# EasyEDA Pro project 单向户外电源_明月班.epro, schematic 后级H桥逆变

## Sheets
1 后级逆变: Board Name: 后级; Create Date: 2025-08-22; Page Name: 后级逆变; Project Name: 单向户外电源; Schematic Name: 后级H桥逆变; Update Date: 2025-09-10; Company: 嘉立创EDA; Page Size: A4; Version: V1.0
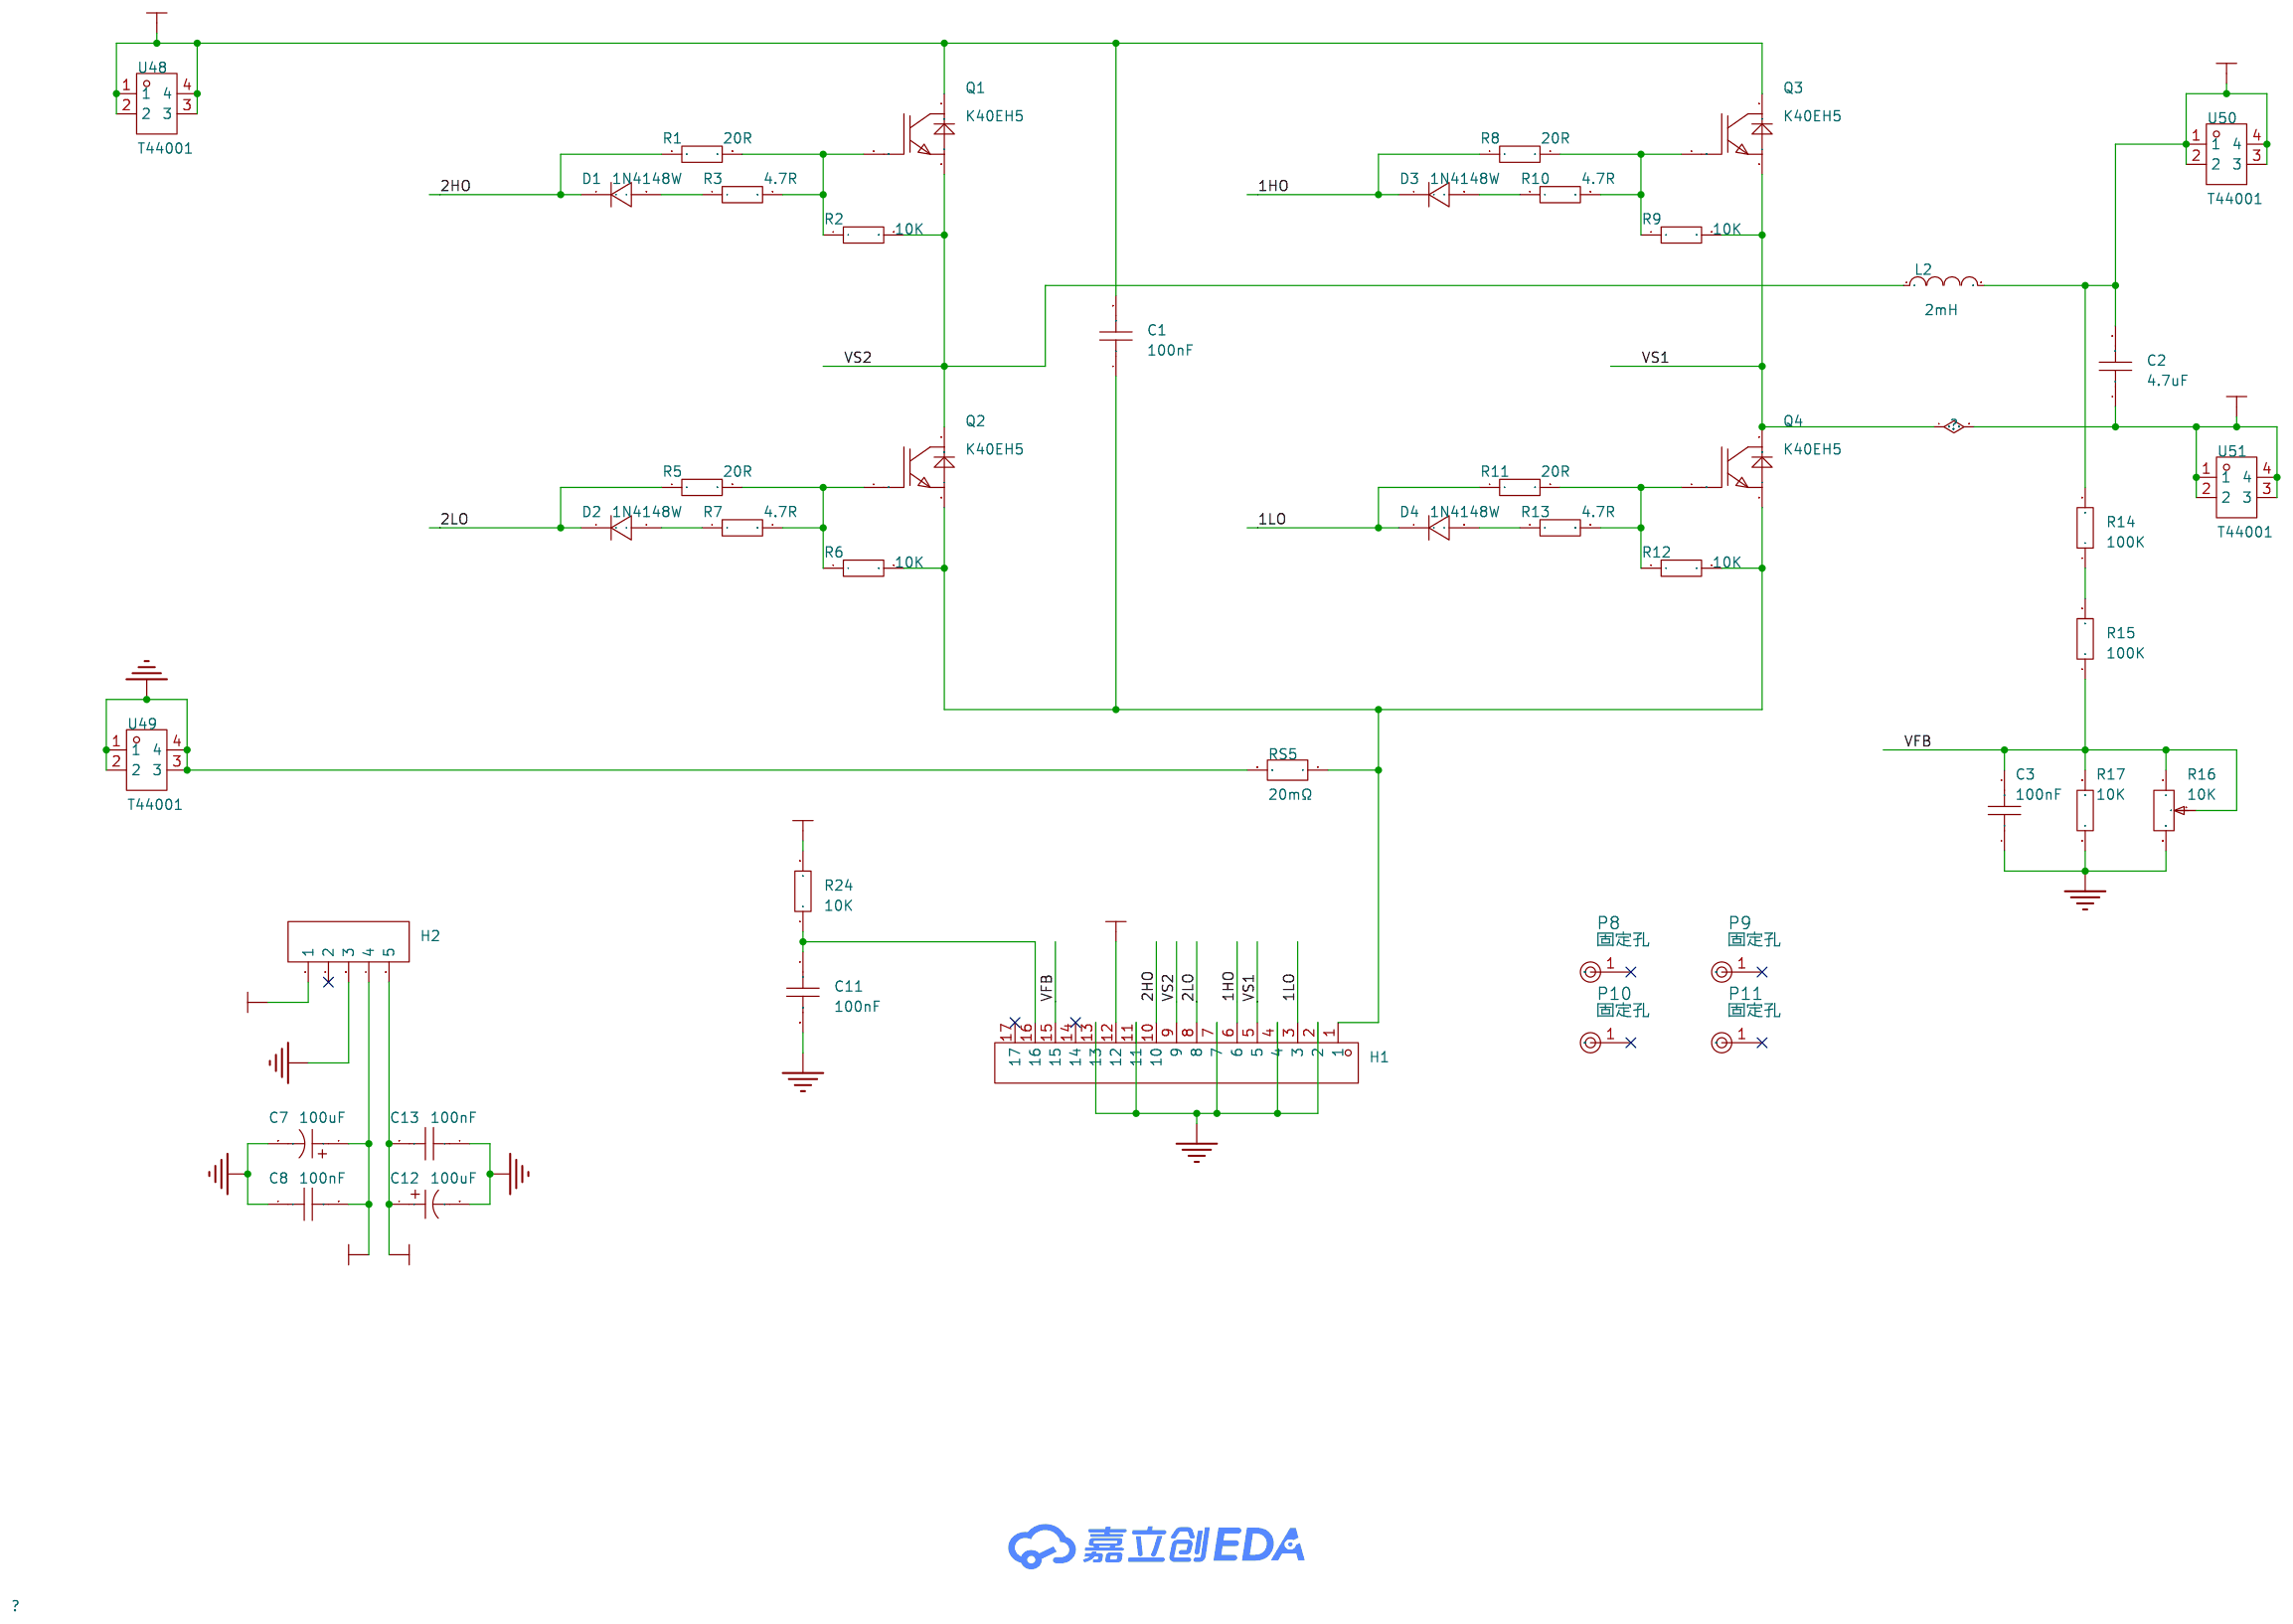
[diagram p3: 后级逆变]
2 P2控制
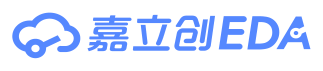
[diagram p4: P2控制]

## Parts
C1  100nF  [CAP-TH_L11.5-W5.5-P10.00-D0.6]
C2  4.7uF  [CAP-TH_L28.5-W15.5-P26.0-D0.8]
C3  100nF  [C0805]
C7  100uF  [CAP-TH_BD5.0-P2.00-D0.5-FD-1]
C8  100nF  [C0805]
C11  100nF  [C0805]
C12  100uF  [CAP-TH_BD5.0-P2.00-D0.5-FD-1]
C13  100nF  [C0805]
D1  1N4148W  [SOD-123F_L2.7-W1.6-LS3.8-RD]
D2  1N4148W  [SOD-123F_L2.7-W1.6-LS3.8-RD]
D3  1N4148W  [SOD-123F_L2.7-W1.6-LS3.8-RD]
D4  1N4148W  [SOD-123F_L2.7-W1.6-LS3.8-RD]
H1  -  [HDR-TH_17P-P2.54-V-F]
H2  -  [EG1185辅助电源]
L2  2mH  [2mH-D=36,插件脚距16]
P8  固定孔  [固定孔]
P9  固定孔  [固定孔]
P10  固定孔  [固定孔]
P11  固定孔  [固定孔]
Q1  K40EH5  [TO-220F-3_L10.5-W4.7-P2.54-L]
Q2  K40EH5  [TO-247AC-3_L15.8-W5.0-P5.46-L]
Q3  K40EH5  [TO-247AC-3_L15.8-W5.0-P5.46-L]
Q4  K40EH5  [TO-247AC-3_L15.8-W5.0-P5.46-L]
R1  20R  [R0805]
R2  10K  [R0805]
R3  4.7R  [R0805]
R5  20R  [R0805]
R6  10K  [R0805]
R7  4.7R  [R0805]
R8  20R  [R0805]
R9  10K  [R0805]
R10  4.7R  [R0805]
R11  20R  [R0805]
R12  10K  [R0805]
R13  4.7R  [R0805]
R14  100K  [R0805]
R15  100K  [R0805]
R16  10K  [RES-ADJ-TH_3362P]
R17  10K  [R0805]
R24  10K  [R0805]
RS5  20mΩ  [R2512]
U48  T44001  [CONN-TH_T44001]
U49  T44001  [CONN-TH_T44001]
U50  T44001  [CONN-TH_T44001]
U51  T44001  [CONN-TH_T44001]

## Library data of the parts
C1 = CBB21-630V104JP10: 容值:100nF;精度:±5%;额定电压:630V;工作温度:-40℃~+105℃;; LCSC Part Name: 100nF ±5% 630V; Supplier Part: C2888191; Manufacturer: 东通电子; Supplier Footprint: 插件,P=10mm; JLCPCB Part Class: 扩展库; Datasheet: https://atta.szlcsc.com/upload/public/pdf/source/20210928/C2888191_1A852CE2E5E8A960951618999EAEF1BB.pdf; Supplier: LCSC; Tolerance: ±5%; Voltage Rated: 630V; Operating Temperature: -40℃~+105℃
C2 = KP475J2J2603: 容值:4.7uF;精度:±5%;额定电压:630V;工作温度:-40℃~+100℃;; LCSC Part Name: 4.7uF ±5% 630V; Supplier Part: C3019080; Manufacturer: KYET(科雅); Supplier Footprint: 插件,P=26mm; JLCPCB Part Class: 扩展库; Datasheet: https://atta.szlcsc.com/upload/public/pdf/source/20220523/12B2B36D66F3FE6DA8C3B05150F96247.pdf; Supplier: LCSC; Tolerance: ±5%; Voltage Rated: 630V; Operating Temperature: -40℃~+100℃
C3 C8 C11 C13 = CAP_0805: Supplier Footprint: 0805
C7 C12 = JBLE2101M025A080RLM 100UF 25V: 容值:100uF;精度:±20%;额定电压:25V;纹波电流:1.1A@100kHz;等效串联电阻(ESR):40mΩ@100kHz;; LCSC Part Name: 100uF ±20% 25V; Supplier Part: C19270657; Manufacturer: DMBJ(振宝佳); Supplier Footprint: 插件,D5xL8mm; JLCPCB Part Class: 扩展库; Datasheet: https://atta.szlcsc.com/upload/public/pdf/source/20240115/41B2053578AA7A05F5193847DE8DA961.pdf; Supplier: LCSC; Tolerance: ±20%; Voltage Rating: 25V; Ripple Current: 1.1A@100kHz; Equivalent Series Resistance(ESR): 40mΩ@100kHz; Lifetime: 2000hrs@105℃
D1-D4 = 1N4148W_C81598: 二极管配置:独立式;正向压降(Vf):1V@50mA;直流反向耐压(Vr):75V;整流电流:150mA;反向恢复时间(Trr):4ns;; Supplier Part: C81598; Manufacturer: ST(先科); Supplier Footprint: SOD-123; JLCPCB Part Class: 基础库; Datasheet: https://item.szlcsc.com/datasheet/1N4148W/82750.html; Supplier: LCSC; Diode Configuration: 独立式; Voltage - Forward(Vf@If): 1V@50mA; Voltage - DC Reverse(Vr): 75V; Current - Rectified: 150mA; Pd - Power Dissipation: 400mW; Reverse Leakage Current (Ir): 1uA@75V; Reverse Recovery Time (trr): 4ns; Non-Repetitive Peak Forward Surge Current: 1A
H1 = HDR-F_2.54_1x17P: Supplier Part: C2897380; Supplier Footprint: 插件
H2 = HDR-F_2.54_1x5P: Supplier Part: C50950; Supplier Footprint: 插件
L2 = XR050125T101MVL7: 电感值:100uH;精度:±10%;额定电流:3.8A;类型:磁环电感;; LCSC Part Name: 100uH ±10% 磁环电感; Supplier Part: C18213920; Manufacturer: XR(祥如); Supplier Footprint: 插件,D=15.8mm; JLCPCB Part Class: 扩展库; Datasheet: https://atta.szlcsc.com/upload/public/pdf/source/20231010/3953EFE02023CF281EBE5E0AF59C2C67.pdf; Supplier: LCSC; Tolerance: ±10%; Rated Current: 3.8A; Type: 磁环电感; Wire Diameter: 0.7mm
P8-P11 = 固定孔
Q1-Q4 = IKW20N60T: Vce=600V，Ic=20A，Vce(sat)=1.5V; Supplier Part: C10456; Manufacturer: Infineon(英飞凌); Supplier Footprint: TO-247AC-3; JLCPCB Part Class: 扩展库; Datasheet: https://atta.szlcsc.com/upload/public/pdf/source/20121215/1457706569365.pdf; Supplier: LCSC
R1-R3 R5-R15 R17 R24 = Res_0805: Supplier Footprint: 0805
R16 = 3362P-1-104_C5048: 阻值:-;功率:-;; LCSC Part Name: 100KΩ ±10% ±250ppm/℃; Supplier Part: C5048; Manufacturer Part: 3362P-1-104; Supplier Footprint: 3362P; JLCPCB Part Class: 扩展库; Supplier: LCSC
RS5 = RLP25FEGR010: 阻值:10mΩ;精度:±1%;功率:3W;温度系数:±50ppm/℃;; LCSC Part Name: 10mΩ ±1% 3W; Supplier Part: C393070; Manufacturer: 大毅科技; Supplier Footprint: 2512; JLCPCB Part Class: 扩展库; Datasheet: https://atta.szlcsc.com/upload/public/pdf/source/20191209/C467441_D59F70B0A5C6980F35DB1CB3CCA97CC4.pdf; Supplier: LCSC; Tolerance: ±1%; Power(Watts): 3W; Temperature Coefficient: ±50ppm/℃
U48-U51 = T44001: LCSC Part Name: 四脚 M4 二件套; Supplier Part: C481447; Manufacturer: XFCN(兴飞); Supplier Footprint: 插件; JLCPCB Part Class: 扩展库; Datasheet: https://atta.szlcsc.com/upload/public/pdf/source/20200107/C481448_4214B4EB74A46B70BD82BA8A456D4EDD.pdf; Supplier: LCSC

## Nets
5V: C12.1 C13.2 H2.5 R24.2
15V: C7.1 C8.2 H1.12 H2.4
400V: C1.2 H2.1 Q1.2(C) Q3.2(C) U48.1 U48.2 U48.3 U48.4
GND-400V: C3.1 C7.2 C8.1 C11.2 C12.2 C13.1 H1.2 H1.4 H1.7 H1.11 H1.13 H2.3 R16.3 R17.1 RS5.2 U49.1 U49.2 U49.3 U49.4
1HO: D3.1(K) H1.6 R8.1
1LO: D4.1(K) H1.3 R11.1
2HO: D1.1(K) H1.10 R1.1
2LO: D2.1(K) H1.8 R5.1
L: C2.2 L2.2 R14.2 U50.1 U50.2 U50.3 U50.4
N: C2.1 H1.5 Q3.3(E) Q4.2(C) R9.2 U51.1 U51.2 U51.3 U51.4
VFB: C3.2 H1.15 R15.1 R16.1 R16.2 R17.2
VS2: H1.9 L2.1 Q1.3(E) Q2.2(C) R2.2
$1N462: D1.2(A) R3.1
$1N467: Q1.1(G) R1.2 R2.1 R3.2
$1N750: D2.2(A) R7.1
$1N752: Q2.1(G) R5.2 R6.1 R7.2
$1N762: C1.1 H1.1 Q2.3(E) Q4.3(E) R6.2 R12.2 RS5.1
$1N1150: D3.2(A) R10.1
$1N1152: Q3.1(G) R8.2 R9.1 R10.2
$1N1168: D4.2(A) R13.1
$1N1170: Q4.1(G) R11.2 R12.1 R13.2
$1N1865: R14.1 R15.2
$1N2358: C11.1 H1.16 R24.1

Not connected (* = marked no-connect by the designer): H1 14* 17*; H2 2*; P8 1(3mm洞)*; P9 1(3mm洞)*; P10 1(3mm洞)*; P11 1(3mm洞)*
